# Altium project ESP32 KIT.PrjPcb
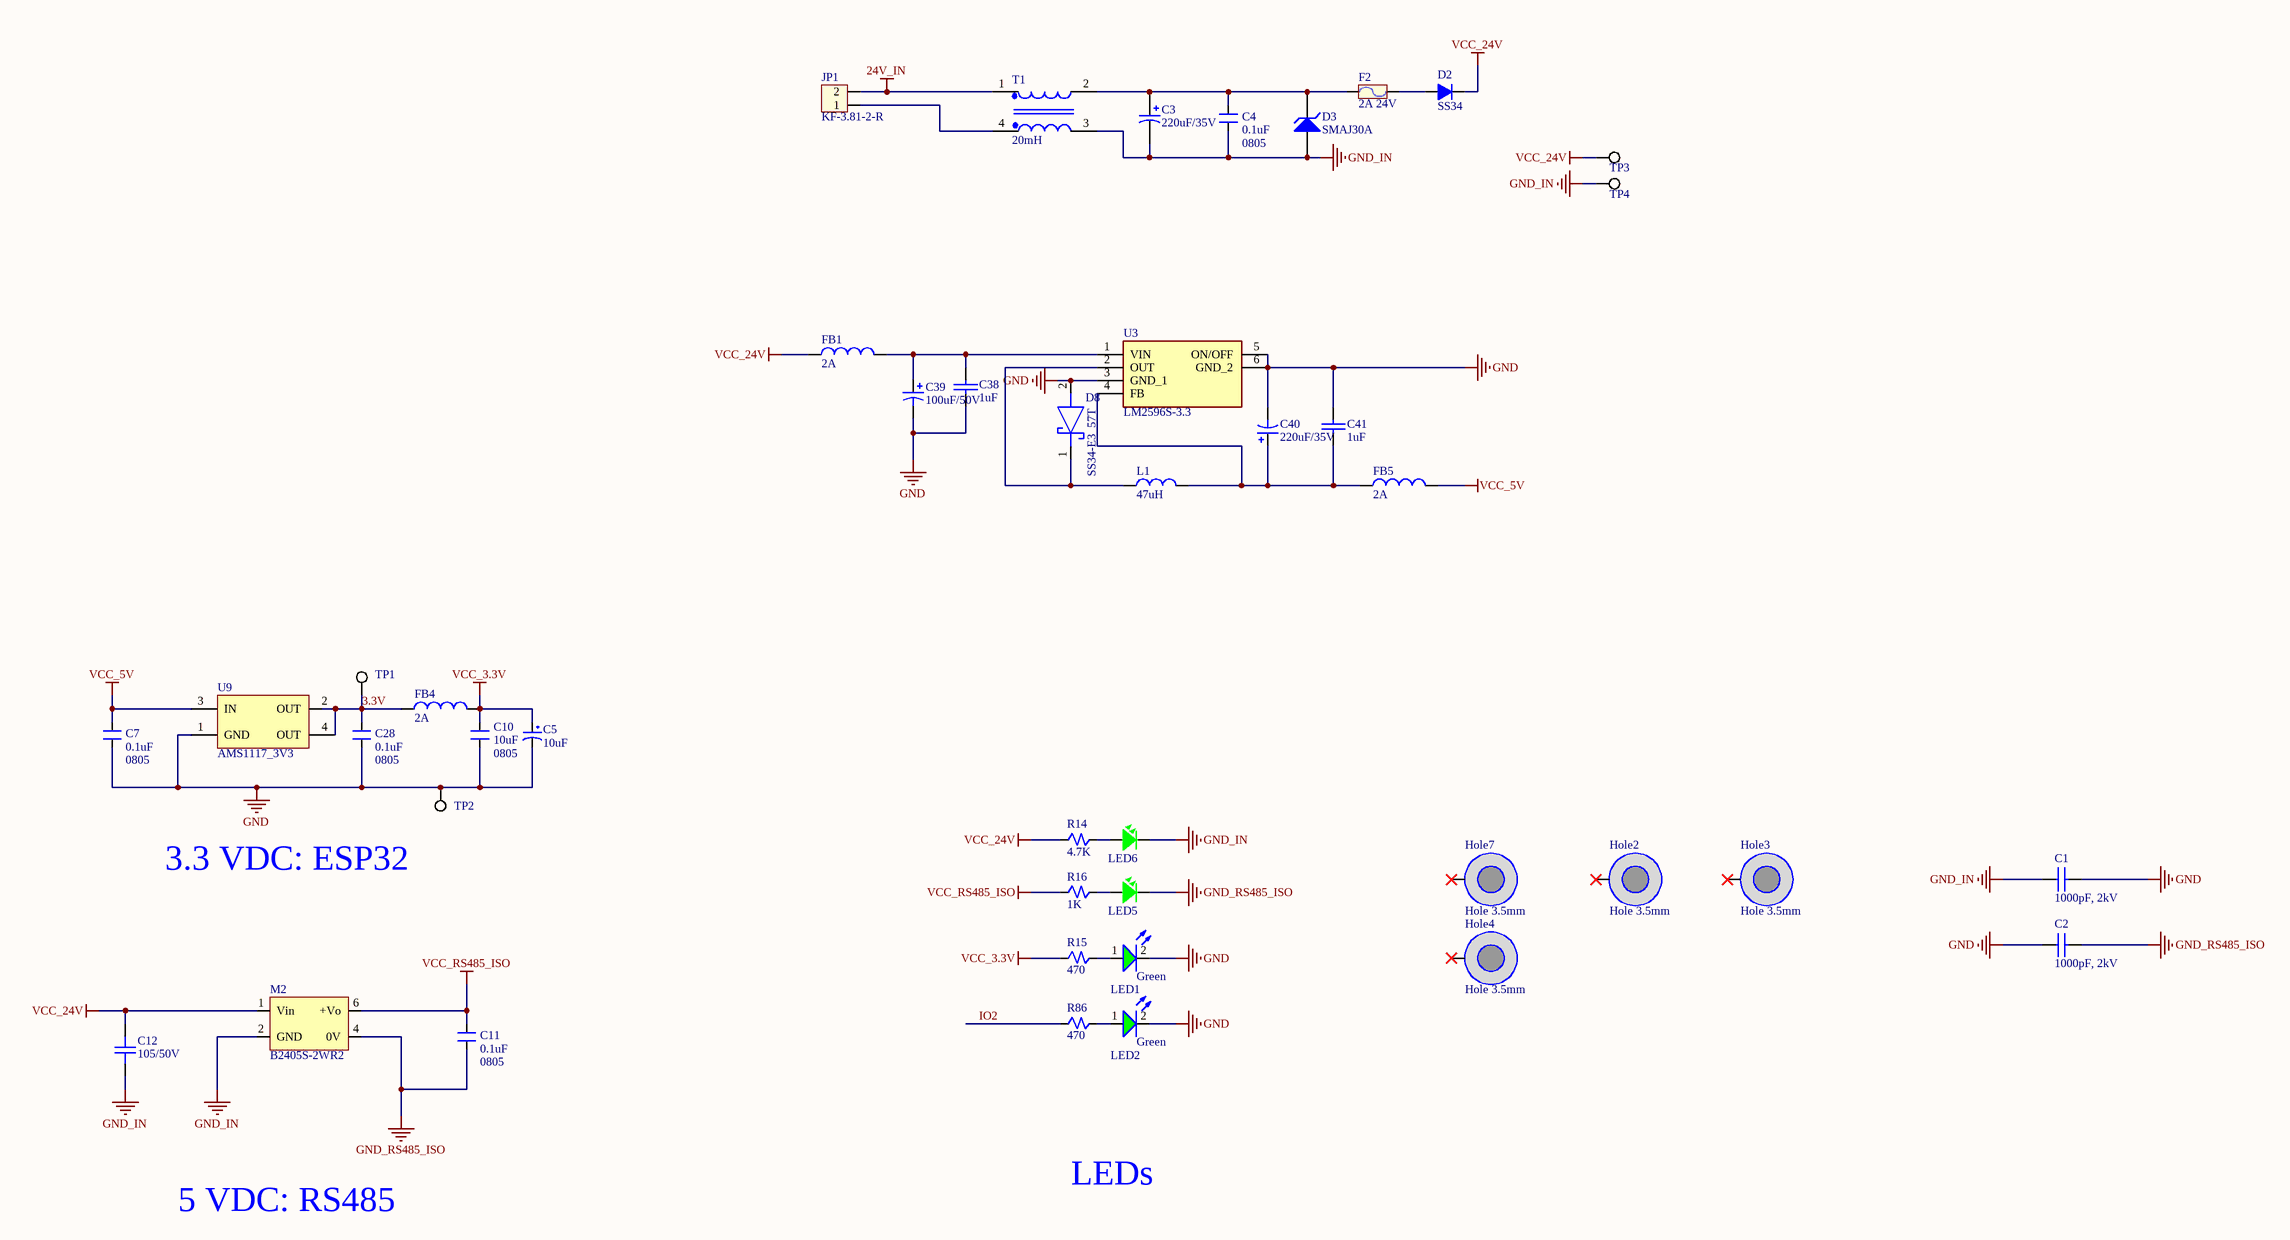
[diagram p0: [1] PWR.SchDoc]
3 sheets, 129 parts. Net scope: global (net labels, ports and power ports of the same name join across sheets).
Board file: ESP32_PCB.PcbDoc
Sheets:
  [1] PWR.SchDoc
  [2] ESP32.SchDoc
  [3] USB.SchDoc

## Sheet [1] PWR.SchDoc: ESP32 KIT
size C; Organization: Altium Limited; Address1: L3, 12a Rodborough Rd; Address2: Frenchs Forest; Address3: NSW; Address4: Australia 2086; DocumentNumber: 1; Revision: 1.0; SheetNumber: 1; SheetTotal: 3

### Parts
C1  1000pF, 2kV  [C1206]
C2  1000pF, 2kV  [C1206]
C3  220uF/35V  [CAP_ALUM_SMD_80102_TYPE_F]
C4  0.1uF  Package: 0805  [CN-SMD-0805]
C5  10uF  [tu tantalum smd3528]
C7  0.1uF  Package: 0805  [CN-SMD-0805]
C10  10uF  Package: 0805  [CN-SMD-0805]
C11  0.1uF  Package: 0805  [CN-SMD-0805]
C12  105/50V  [CAPC-1210 (3225)]
C28  0.1uF  Package: 0805  [CN-SMD-0805]
C38  1uF  [CN-SMD-0805]
C39  100uF/50V  [CAP SMD ALU SIZE F]
C40  220uF/35V  [CAP SMD ALU SIZE F]
C41  1uF  [CN-SMD-0805]
D2  SS34  [diot_smd]
D3  SMAJ30A  [DIODE_DO214AC_SMA]
D8  SS34-E3_57T  [diot_smd]
F2  2A 24V  [RES-SMD-1812]
FB1  2A  [INDC0805]
FB4  2A  [INDC0805]
FB5  2A  [INDC0805]
Hole2  Hole 3.5mm  [Screw Hole 3.5mm]
Hole3  Hole 3.5mm  [Screw Hole 3.5mm]
Hole4  Hole 3.5mm  [Screw Hole 3.5mm]
Hole7  Hole 3.5mm  [Screw Hole 3.5mm]
JP1  KF-3.81-2-R  [KF-3.81-2-R]
L1  47uH  [XL]
LED1  value Green  [LED5G]  (hidden comment: LED_G_5)
LED2  value Green  [LED5G]  (hidden comment: LED_G_5)
LED5  0805 Green  [LED-0805-Blue]  (value not drawn)
LED6  0805 Green  [LED-0805-Blue]  (value not drawn)
M2  B2405S-2WR2  [B_S-2WR2]
R14  4.7K  [RES_0805]
R15  470  [RES_0805]
R16  1K  [RES_0805]
R86  470  [RES_0805]
T1  20mH  [UU9.8-10mH]
TP1  TP 2x2mm  [TP 1.5x1.5mm]  (value not drawn)
TP2  TP 2x2mm  [TP 1.5x1.5mm]  (value not drawn)
TP3  TP 2x2mm  [TP 1.5x1.5mm]  (value not drawn)
TP4  TP 2x2mm  [TP 1.5x1.5mm]  (value not drawn)
U3  LM2596S-3.3  [TO-263]
U9  AMS1117_3V3  [SOT223-4M]

### Nets
24V_IN: JP1.2 T1.1(IN1)
GND: C1.2 C2.1 C5.2 C7.1 C10.1 C28.1 C38.2 C39.2 C40.2 C41.1 D8.2(A) LED1.2(K) LED2.2(K) TP2.3 U3.3(GND_1) U3.5(ON/OFF) U3.6(GND_2) U9.1(GND)
GND_IN: C1.1 C3.2 C4.1 C12.1 D3.1(A) LED6.2 M2.2(GND) T1.3(OUT2) TP4.3
GND_RS485_ISO: C2.2 C11.1 LED5.2 M2.4(0V)
VCC_3.3V: C5.1 C10.2 FB4.2 R15.1
VCC_5V: C7.2 FB5.2 U9.3(IN)
VCC_24V: C12.2 D2.2(K) FB1.1 M2.1(Vin) R14.1 TP3.3
VCC_RS485_ISO: C11.2 M2.6(+Vo) R16.1
3.3V: C28.2 FB4.1 TP1.3 U9.2(OUT) U9.4(OUT)
IO2: R86.1
NetC3_1: C3.1 C4.2 D3.2(K) F2.1 T1.2(IN2)
NetC38_1: C38.1 C39.1 FB1.2 U3.1(VIN)
NetC40_1: C40.1 C41.2 FB5.1 L1.2 U3.4(FB)
NetD2_1: D2.1(A) F2.2
NetD8_1: D8.1(K) L1.1 U3.2(OUT)
NetJP1_1: JP1.1 T1.4(OUT1)
NetLED1_1: LED1.1(A) R15.2
NetLED2_1: LED2.1(A) R86.2
NetLED5_1: LED5.1 R16.2
NetLED6_1: LED6.1 R14.2

Not connected (* = marked no-connect by the designer): Hole2 1(hole)*; Hole3 1(hole)*; Hole4 1(hole)*; Hole7 1(hole)*

### Notes on the sheet
- (near TP2) 3.3 VDC: ESP32
- 5 VDC: RS485
- LEDs
- Title
- Size:
- Date:
- File:
- C
- Number:
- Time:
- Revision:
- Sheet
- of

### Library data of the parts
C1 C2 = C1206X102KGRACTU: CAP CER 1000PF 2000V X7R 1206 FT; Manufacturer: Kemet; .Checked PCB: used; Voltage - Rated: 2000V (2kV); Tolerance: ±10%; Cross PN: C1206C102KGRACAUTO; Cross DES: CAP CER 1000PF 2KV X7R 1206; Capacitance: 1000pF; Category: Capacitors; Supplier Part Number: 399-5830-1-ND; Part Number: C1206X102KGRACTU; Operating Temperature: -55°C ~ 125°C; Package / Case: 1206 (3216 Metric); Price 1k [$]: 0.27600; Value: 1000pF, 2kV; .Checked SCH: used; Supplier: Digikey; Supplier 1: Digi-Key; Supplier Part Number 1: 399-5830-1-ND; RoHS: RoHS Compliant; Stock 1: 2068; Pricing 1: 1=0.92, 10=0.771, 25=0.6324, 100=0.483, 250=0.37952, 500=0.345, 1000=0.276 (USD); Temperature Coefficient: X7R; Mounting Type: Surface Mount, MLCC; Applications: Boardflex Sensitive; Ratings: -; Size / Dimension: 0.134" L x 0.063" W (3.40mm x 1.60mm); Height - Seated (Max): -; Thickness (Max): 0.069" (1.75mm); Lead Spacing: -; Features: Soft Termination, High Voltage; Packaging: Cut Tape (CT); Lead Style: -; ComponentLink1URL: http://www.kemet.com/kemet/web/homepage/kechome.nsf/weben/8311688D32A99EF8852578B500644843/$file/KEM_CC105_HIVOLT.pdf; ComponentLink1Description: http://www.kemet.com/kemet/web/homepage/kechome.nsf/weben/8311688D32A99EF8852578B500644843/$file/KEM_CC105_HIVOLT.pdf; Cross MNF: KEMET
C3 = EEE-FK1V221P: CAP ALUM 220uF 20% 35V SMD; Manufacturer: Panasonic; Solder: SMT; Cross PN: TGIC/25TLV220M8X10.5; Cross DES: Tụ Nhôm SMD 220uF 35V 8x10.5mm; Cross MNF: Thế Giới IC; Value: 220uF/35V; Category: CAPACITOR; PinCount: 2; Part Number: EEE-FK1V221P
C4 C7 C11 C28 = CAP 0.1uF 0805 10% 50V: CAP CER 0.1UF 50V 0805; Manufacturer: Minh Hà; Part Number: Tụ 0805 104-100nF 10% 50V; Tolerance: 10%; Dielectric: X5R; Voltage: 50V; ComponentLink1Description: Link VN; ComponentLink1URL: https://banlinhkien.com/tu-0805-104100nf-10-50v-10c-p6650428.html; Value: 0.1uF; Supplier: Minh Hà; Buy Link: https://banlinhkien.com/tu-0805-104100nf-10-50v-10c-p6650428.html
C5 = Tu tantalum 10uF 16V SMD3528: Dán; Don_Vi: Con; So_Chan: 2; Ten_Linh_Kien: Tụ tantalum 106C-10uF 16V SMD3528; Ma_Hang: MH007474; Chung_Loai: Dán; Kieu_Chan: *
C10 = CAP 10uF 0805 10% 16V: CAP CER 10UF 16V 0805; Manufacturer: Minh Hà; Part Number: Tụ 0805 106-10uF 10% 16V; Tolerance: 10%; Dielectric: X5R; ComponentLink1Description: Link VN; ComponentLink1URL: https://banlinhkien.com/tu-0805-10610uf-10-16v-10c-p6650430.html; Value: 10uF
C12 = CC1210KKX7R9BB105: CAP CER 1UF 50V X7R 1210; Manufacturer: Yageo; Solder: SMT; Value: 105/50V; Category: CAPACITOR; PinCount: 2; Part Number: CC1210KKX7R9BB105
C38 C41 = CAP: Capacitor
C39 = 100uF/50V/RADIAL 8X11.5/20%: CAP ALUM 100UF 20% 50V RADIAL; Manufacturer: Panasonic Electronic Components; Manufacturer Part Number: ECA-1HM101B; Capacitance: 100µF; Lifetime @ Temp.: 2000 Hrs @ 85°C; Ripple Current: 250mA; Supplier 1: Digi-Key; RoHS: RoHS Compliant; Category: Capacitors; Stock 1: 24000; Pricing 1: 1000=0.08607, 2000=0.08154, 5000=0.07701, 10000=0.07248, 25000=0.06795, 50000=0.06342, 100000=0.05889 (USD); Packaging: Tape & Box (TB); Tolerance: ±20%; Voltage Rating: 50V; ESR (Equivalent Series Resistance): -; Operating Temperature: -40°C ~ 85°C; Type: -; Applications: General Purpose; Impedance: -; Lead Spacing: 0.197" (5.00mm); Size / Dimension: 0.315" Dia (8.00mm); Height - Seated (Max): 0.492" (12.50mm); Surface Mount Land Size: -; Mounting Type: Through Hole; Package / Case: Radial, Can; ComponentLink1URL: http://industrial.panasonic.com/www-cgi/jvcr13pz.cgi?E+PZ+3+ABA0012+ECA1HM101B+7+WW; ComponentLink1Description: http://industrial.panasonic.com/www-cgi/jvcr13pz.cgi?E+PZ+3+ABA0012+ECA1HM101B+7+WW
C40 = 270uF/35V/RADIAL 8X11.5/20%: CAP ALUM 270UF 20% 35V RADIAL; Manufacturer: Panasonic Electronic Components; Manufacturer Part Number: EEU-FR1V271LB; Capacitance: 270µF; Lifetime @ Temp.: 8000 Hrs @ 105°C; Ripple Current: 1.24A; Impedance: 41 mOhm; Supplier 1: Digi-Key; RoHS: RoHS Compliant; Category: Capacitors; Stock 1: 2000; Pricing 1: 1000=0.17765, 2000=0.1672, 5000=0.15675, 10000=0.1463, 25000=0.14108, 50000=0.13585, 100000=0.13063 (USD); Packaging: Tape & Box (TB); Tolerance: ±20%; Voltage Rating: 35V; ESR (Equivalent Series Resistance): -; Operating Temperature: -40°C ~ 105°C; Type: -; Applications: General Purpose; Lead Spacing: 0.197" (5.00mm); Size / Dimension: 0.315" Dia (8.00mm); Height - Seated (Max): 0.650" (16.50mm); Surface Mount Land Size: -; Mounting Type: Through Hole; Package / Case: Radial, Can; ComponentLink1URL: http://media.digikey.com/pdf/Data%20Sheets/Panasonic%20Electronic%20Components/EEU-FR_Series.pdf; ComponentLink1Description: http://media.digikey.com/pdf/Data%20Sheets/Panasonic%20Electronic%20Components/EEU-FR_Series.pdf; Supplier Part Number 1: P15388TB-ND
D2 = SS34_SMA: DIODE SMD S3M 1N5822 3A 40V SMA; Manufacturer: Minh Hà; Value: 40V/3A; Part Number: SS34; Current: 3A; Voltage: 40V; Package: SMA; ComponentLink1Description: Link VN; ComponentLink1URL: https://banlinhkien.com/diode-ss34-3a-40v-sma-1n5822-ss34a-p6652165.html
D3 = SMAJ30A: TVS DIODE 30V 48.4V DO214AC; Manufacturer: Littelfuse Inc; Solder: SMT; Value: SMAJ30A; Part Number: SMAJ30A
D8 = SS34-E3_57T: Schottky Diode; Manufacturer_Name: Vishay; Manufacturer_Part_Number: SS34-E3/57T; Datasheet Link: https://www.vishay.com/docs/88751/ss32.pdf; Height: 2.62mm; Arrow Part Number: SS34-E3/57T; Arrow Price/Stock: https://www.arrow.com/en/products/ss34-e357t/vishay; Mouser Part Number: 625-SS34-E3; Mouser Price/Stock: https://www.mouser.co.uk/ProductDetail/Vishay-General-Semiconductor/SS34-E3-57T?qs=x2jpVgRnAtMC3f38kYWnRw%3D%3D
F2 = FUSE 2A 24V: Cầu Chì Tự Phục Hồi 2A 24V SMD1812; Manufacturer: Minh Hà; Part Number: MH010033
FB1 FB4 FB5 = FERRITE BEAD_CBW201209U121T: FERRITE BEAD 100 mOhm DCR 2A 120 OHM 0805; Manufacturer: Fenghua Electronics; Part Number: CBW201209U121T; Supplier: Thế Giới IC; Buy Link: https://www.thegioiic.com/products/cbw201209u121t-ferrite-bead-2a-120-ohm-0805
Hole2-Hole4 Hole7 = Hole 3.5mm: VIT Hole 3.5mm; Part Number: VIT 3.5mm; Manufacturer: Temas
JP1 = Con_2C: Terminal Block Plug-in Hàn PCB Chân Cong 3.81mm; Value: Connector 3; BuyLink: https://www.thegioiic.com/products/kf142-5-08-3-r-terminal-block-3-tiep-diem-cam-day-ngang-5-08mm; ComponentLink1Description: Buy link; ComponentLink1URL: https://www.thegioiic.com/products/kf-3-81-3-r-terminal-block-plug-in-han-pcb-3-chan-cong-3-81mm
L1 = Inductor: Value: 150 mH
LED1 LED2 = LED_GREEN_5MM: LED Green 5mm; ComponentLink1Description: Datasheet; ComponentLink1URL: D:\Dropbox\Datasheets\Opto and Illumination\LEDs\SMD LED.pdf; Unit Price: 0.0476
LED5 LED6 = LED 0805 Màu Xanh Lá (Green): Manufacturer: Minh Hà; Value: Green; Part Number: LED 0805 Màu Xanh Lá (Green); ComponentLink1Description: Link VN; ComponentLink1URL: https://banlinhkien.com/led-0805-mau-xanh-la-green5c-p19524188.html
M2 = B2405S-2WR2: MODULE 24-05V 0.4A Isolated 2W; Manufacturer: Mornsun; Part Number: B2405S-2WR2; ComponentLink1Description: Link VN; ComponentLink1URL: https://www.thegioiic.com/products/b2405s-2wr2-chuyen-doi-dc-dc-vao-24v-ra-5v-2w
R14 = RES 4.7K 0805 1% 1/8W: Điện Trở 4.7 KOhm 0805 1% 1/8W /; Part Number: Trở 0805 1% 4.7K; Manufacturer: Minh Hà; ComponentLink1Description: Link VN; ComponentLink1URL: https://banlinhkien.com/tro-0805-1-4.7k-50c-p12913923.html; Package: 0805; Tolerance: 1%; Power: 1/8W
R15 R86 = RES 470R 0805 1% 1/8W: Điện Trở 470 Ohm 0805 1% 1/8W /; Part Number: Trở 0805 1% 470R; Manufacturer: Minh Hà; ComponentLink1Description: Link VN; ComponentLink1URL: https://banlinhkien.com/tro-0805-1-470r-50c-p17823145.html; Package: 0805; Tolerance: 1%; Power: 1/8W
R16 = RES 1K 0805 1% 1/8W: Điện Trở 1 KOhm 0805 1% 1/8W /; Part Number: Trở 0805 1% 1K; Manufacturer: Minh Hà; ComponentLink1Description: Link VN; ComponentLink1URL: https://banlinhkien.com/tro-0805-1-1k-50c-p6651948.html; Package: 0805; Tolerance: 1%; Power: 1/8W
T1 = UU9.8-203: Power Transformers 20mH; Manufacturer: OEM; ComponentLink1Description: New link; ComponentLink1URL: *; Part Number: UU9.8-203
TP1-TP4 = TP 2x2mm: Test Point 2x2mm; Manufacturer: TEMAS; Part Number: TEST POINT 2x2MM
U3 = LM2596S-3.3: Integrated Circuit; Manufacturer_Name: Texas Instruments; Datasheet Link: http://www.ti.com/lit/ds/symlink/lm2596.pdf; Height: 4.65mm; Manufacturer_Part_Number: LM2596S-3.3; Arrow Part Number: LM2596S-3.3; Arrow Price/Stock: https://www.arrow.com/en/products/lm2596s-3.3/texas-instruments; Mouser Part Number: 926-LM2596S-33; Mouser Price/Stock: https://www.mouser.co.uk/ProductDetail/Texas-Instruments/LM2596S-33?qs=X1J7HmVL2ZHnG50G34wg0g%3D%3D
U9 = AMS1117_3V3: 1A Regulator

## Sheet [2] ESP32.SchDoc: ESP32 KIT
size C; Organization: Altium Limited; Address1: L3, 12a Rodborough Rd; Address2: Frenchs Forest; Address3: NSW; Address4: Australia 2086; DocumentNumber: 2; Revision: 1.0; SheetNumber: 2; SheetTotal: 3
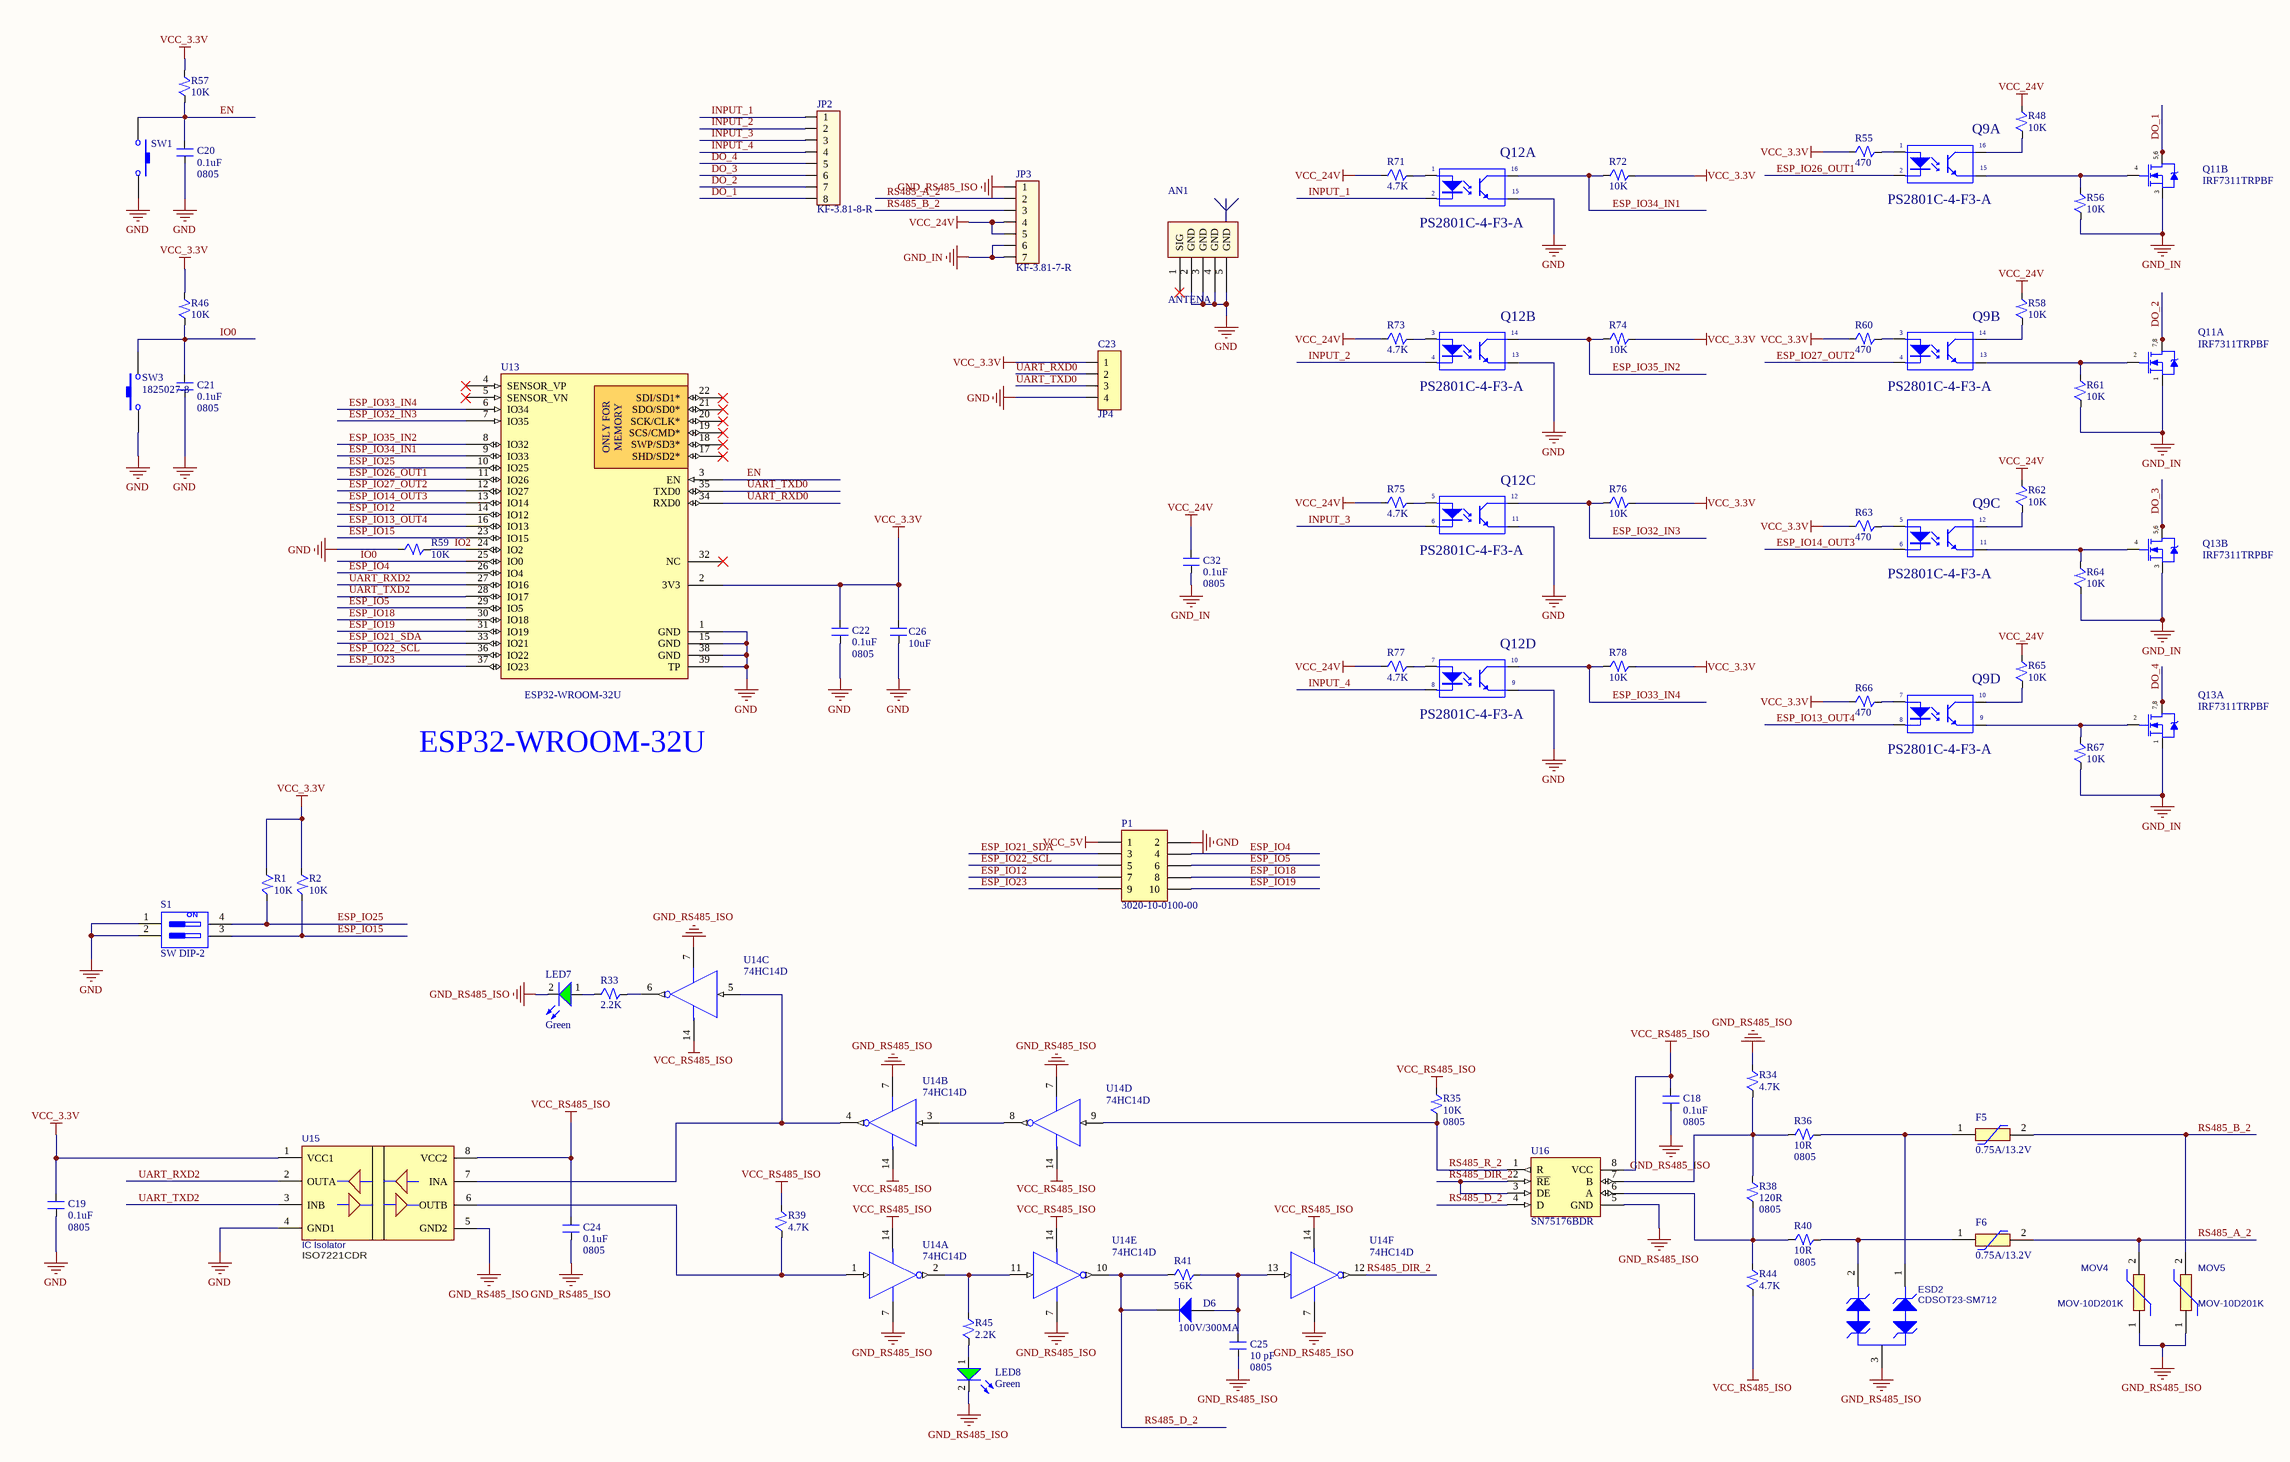
[diagram p1: [2] ESP32.SchDoc]

### Parts
AN1  ANTENA  [DE ANTEN SMA CONG]
C18  0.1uF  Package: 0805  [CN-SMD-0805]
C19  0.1uF  Package: 0805  [CN-SMD-0805]
C20  0.1uF  Package: 0805  [CN-SMD-0805]
C21  0.1uF  Package: 0805  [CN-SMD-0805]
C22  0.1uF  Package: 0805  [CN-SMD-0805]
C23  JP4  [JP4-C1T]
C24  0.1uF  Package: 0805  [CN-SMD-0805]
C25  10 pF  Package: 0805  [CN-SMD-0805]
C26  10uF  [CN-SMD-0805]
C32  0.1uF  Package: 0805  [CN-SMD-0805]
D6  100V/300MA  [SOD-123]
ESD2  CDSOT23-SM712  [SOT-323_ESD]
F5  0.75A/13.2V  [MINISMDC050F2]
F6  0.75A/13.2V  [MINISMDC050F2]
JP2  KF-3.81-8-R  [KF-3.81-8-R]
JP3  KF-3.81-7-R  [KF-3.81-7-R]
LED7  value Green  [LED5G]  (hidden comment: LED_G_5)
LED8  value Green  [LED5G]  (hidden comment: LED_G_5)
MOV4  MOV-10D201K  [MOV10D201KTR]
MOV5  MOV-10D201K  [MOV10D201KTR]
P1  3020-10-0100-00  [IDC_HDR_M_2X5_2.54_THG]
Q9  PS2801C-4-F3-A  [PS2801C-4_REN-L]  (parts A,B,C,D of 4)
Q11  IRF7311TRPBF  [SO8]  (parts A,B of 2)
Q12  PS2801C-4-F3-A  [PS2801C-4_REN-L]  (parts A,B,C,D of 4)
Q13  IRF7311TRPBF  [SO8]  (parts A,B of 2)
R1  10K  [RES_0805]
R2  10K  [RES_0805]
R33  2.2K  [RES_0805]
R34  4.7K  [RES_0805]
R35  10K  Package: 0805  [RES_0805]
R36  10R  Package: 0805  [RES_0805]
R38  120R  Package: 0805  [RES_0805]
R39  4.7K  [RES_0805]
R40  10R  Package: 0805  [RES_0805]
R41  56K  [RES_0805]
R44  4.7K  [RES_0805]
R45  2.2K  [RES_0805]
R46  10K  [RES_0805]
R48  10K  [RES_0805]
R55  470  [RES_0805]
R56  10K  [RES_0805]
R57  10K  [RES_0805]
R58  10K  [RES_0805]
R59  10K  [RES_0805]
R60  470  [RES_0805]
R61  10K  [RES_0805]
R62  10K  [RES_0805]
R63  470  [RES_0805]
R64  10K  [RES_0805]
R65  10K  [RES_0805]
R66  470  [RES_0805]
R67  10K  [RES_0805]
R71  4.7K  [RES_0805]
R72  10K  [RES_0805]
R73  4.7K  [RES_0805]
R74  10K  [RES_0805]
R75  4.7K  [RES_0805]
R76  10K  [RES_0805]
R77  4.7K  [RES_0805]
R78  10K  [RES_0805]
S1  SW DIP-2  [DIP-SW-2-SIDE ENTRY]
SW1  RS-282G05A3-SM RT  [SW_RS-282G05A3-SM RT]  (value not drawn)
SW3  1825027-8  [SW_1825027-8]
U13  ESP32-WROOM-32U  [ESP32-WROOM-32U]
U14  74HC14D  [SOIC-14]  (parts A,B,C,D,E,F of 6)
U15  IC Isolator  Part Number: ISO7221CDR  [8-SOIC_ISO]
U16  SN75176BDR  [SOIC-8]

### Nets
GND: AN1.2(GND) AN1.3(GND) AN1.4(GND) AN1.5(GND) C19.1 C20.1 C21.1 C22.1 C23.4 C26.1 P1.2 Q12.9 Q12.11 Q12.13 Q12.15 R59.1 S1.1(A1) S1.2(A2) SW1.2 SW3.1 U13.1(GND) U13.15(GND) U13.38(GND) U13.39(TP) U15.4(GND1)
GND_IN: C32.1 JP3.6 JP3.7 Q11.1(S) Q11.3(S) Q13.1(S) Q13.3(S) R56.1 R61.1 R64.1 R67.1
GND_RS485_ISO: C18.1 C24.1 C25.1 ESD2.3(A) JP3.1 LED7.2(K) LED8.2(K) MOV4.1 MOV5.1 R34.2 U14.7(GND) U15.5(GND2) U16.5(GND)
VCC_3.3V: C19.2 C22.2 C23.1 C26.2 R1.1 R2.1 R46.2 R55.1 R57.2 R60.1 R63.1 R66.1 R72.2 R74.2 R76.2 R78.2 U13.2(3V3) U15.1(VCC1)
VCC_5V: P1.1
VCC_24V: C32.2 JP3.4 JP3.5 R48.2 R58.2 R62.2 R65.2 R71.1 R73.1 R75.1 R77.1
VCC_RS485_ISO: C18.2 C24.2 R35.2 R39.2 R44.1 U14.14(VCC) U15.8(VCC2) U16.8(VCC)
DO_1: JP2.8 Q11.5(D) Q11.6(D)
DO_2: JP2.7 Q11.7(D) Q11.8(D)
DO_3: JP2.6 Q13.5(D) Q13.6(D)
DO_4: JP2.5 Q13.7(D) Q13.8(D)
EN: C20.2 R57.1 SW1.1 U13.3(EN)
ESP_IO4: P1.4 U13.26(IO4)
ESP_IO5: P1.6 U13.29(IO5)
ESP_IO12: P1.7 U13.14(IO12)
ESP_IO13_OUT4: Q9.8 U13.16(IO13)
ESP_IO14_OUT3: Q9.6 U13.13(IO14)
ESP_IO15: R2.2 S1.3(B2) U13.23(IO15)
ESP_IO18: P1.8 U13.30(IO18)
ESP_IO19: P1.10 U13.31(IO19)
ESP_IO21_SDA: P1.3 U13.33(IO21)
ESP_IO22_SCL: P1.5 U13.36(IO22)
ESP_IO23: P1.9 U13.37(IO23)
ESP_IO25: R1.2 S1.4(B1) U13.10(IO25)
ESP_IO26_OUT1: Q9.2 U13.11(IO26)
ESP_IO27_OUT2: Q9.4 U13.12(IO27)
ESP_IO32_IN3: Q12.12 R76.1 U13.7(IO35)
ESP_IO33_IN4: Q12.10 R78.1 U13.6(IO34)
ESP_IO34_IN1: Q12.16 R72.1 U13.9(IO33)
ESP_IO35_IN2: Q12.14 R74.1 U13.8(IO32)
INPUT_1: JP2.1 Q12.2
INPUT_2: JP2.2 Q12.4
INPUT_3: JP2.3 Q12.6
INPUT_4: JP2.4 Q12.8
IO0: C21.2 R46.1 SW3.2 U13.25(IO0)
IO2: R59.2 U13.24(IO2)
RS485_A_2: F6.2 JP3.2 MOV4.2
RS485_B_2: F5.2 JP3.3 MOV5.2
RS485_D_2: D6.2(K) R41.1 U14.10(5Y) U16.4(D)
RS485_DIR_2: U14.12(6Y) U16.2(~{RE}) U16.3(DE)
RS485_R_2: R35.1 U14.9(4A) U16.1(R)
UART_RXD0: C23.2 U13.34(RXD0)
UART_RXD2: U13.27(IO16) U15.2(OUTA)
UART_TXD0: C23.3 U13.35(TXD0)
UART_TXD2: U13.28(IO17) U15.3(INB)
NetC25_2: C25.2 D6.1(A) R41.2 U14.13(6A)
NetESD2_1: ESD2.1(K) F5.1 R36.2
NetESD2_2: ESD2.2(K) F6.1 R40.2
NetLED7_1: LED7.1(A) R33.1
NetLED8_1: LED8.1(A) R45.1
NetQ9_1: Q9.1 R55.2
NetQ9_3: Q9.3 R60.2
NetQ9_5: Q9.5 R63.2
NetQ9_7: Q9.7 R66.2
NetQ9_9: Q9.9 Q13.2(G) R67.2
NetQ9_10: Q9.10 R65.1
NetQ9_11: Q9.11 Q13.4(G) R64.2
NetQ9_12: Q9.12 R62.1
NetQ9_13: Q9.13 Q11.2(G) R61.2
NetQ9_14: Q9.14 R58.1
NetQ9_15: Q9.15 Q11.4(G) R56.2
NetQ9_16: Q9.16 R48.1
NetQ12_1: Q12.1 R71.2
NetQ12_3: Q12.3 R73.2
NetQ12_5: Q12.5 R75.2
NetQ12_7: Q12.7 R77.2
NetR33_2: R33.2 U14.6(3Y)
NetR34_1: R34.1 R36.1 R38.2 U16.7(B)
NetR38_1: R38.1 R40.1 R44.2 U16.6(A)
NetR39_1: R39.1 U14.1(1A) U15.6(OUTB)
NetR45_2: R45.2 U14.2(1Y) U14.11(5A)
NetU14_3: U14.3(2A) U14.8(4Y)
NetU14_4: U14.4(2Y) U14.5(3A) U15.7(INA)

Not connected (* = marked no-connect by the designer): AN1 1(SIG)*; U13 4(SENSOR_VP)* 5(SENSOR_VN)* 17(SHD/SD2*)* 18(SWP/SD3*)* 19(SCS/CMD*)* 20(SCK/CLK*)* 21(SDO/SD0*)* 22(SDI/SD1*)* 32(NC)*

### Notes on the sheet
- ESP32-WROOM-32U
- Title
- Size:
- Date:
- File:
- C
- Number:
- Time:
- Revision:
- Sheet
- of
- (in symbol ESP32-WROOM-32U) ONLY FOR; MEMORY
- (in symbol IRF7311TRPBF, part A) 7,8
- (in symbol IRF7311TRPBF, part B) 5,6
- (in symbol SW DIP-2) ON

### Library data of the parts
AN1 = ANTEN SMA CONG: Generic Antenna
C18-C22 C24 C25 C32 = CAP 0.1uF 0805 10% 50V: as C4 on sheet [1] PWR; Voltage: 50V; ComponentLink1Description: Link VN; ComponentLink1URL: https://banlinhkien.com/tu-0805-104100nf-10-50v-10c-p6650428.html; Value: 0.1uF; Supplier: Minh Hà; Buy Link: https://banlinhkien.com/tu-0805-104100nf-10-50v-10c-p6650428.html
C23 = JP4: WR-PHD 2.54 mm Angled Socket Header; Manufacturer: W¨¹rth Elektronik eiSos GmbH; partNo: 613004143121; ComponentLink1 Description: Manufacturer; ComponentLink2 Description: Datasheet; NoPins: 04; Created Date: 29 March 2013; ComponentLink1URL: http://www.we-online.com; ComponentLink2URL: http://katalog.we-online.de/em/datasheet/6130xx143121.pdf; Created by: Karrer Zheng
C26 = CAP 10uF 0805 10% 16V: as C10 on sheet [1] PWR; Package: 0805; Voltage: 16V; ComponentLink1Description: Link VN; ComponentLink1URL: https://banlinhkien.com/tu-0805-10610uf-10-16v-10c-p6650430.html; Value: 10uF
D6 = 1N4148-W-7: DIODE GEN PURP 100V 300MA SOD123; Part Number: 1N4148W-7-F; Manufacturer: Diodes Incorporated; Value: 100V/300MA
ESD2 = CDSOT23-SM712: ESD 2 channel 12V, 26V Max Voltage Clamp 17A, 13.3V Typ Breakdown Voltage, Max -V Reverse Standoff Voltage, Bidirectional, Capacitance 75 pF Typ; Manufacturer: Bourns; Ma thay the VN: No; Cross PN: PESD24VL2BT,215; Cross DES: TVS DIODE 24VWM 70VC TO236AB 70V Clamp 3A; Cross MNF: Nexperia USA Inc.; Part Number: CDSOT23-SM712; ComponentLink1Description: Datasheet; ComponentLink1URL: https://www.mouser.vn/datasheet/2/54/CDSOT23-SM712-1635169.pdf; ComponentLink2Description: Link tham khao; ComponentLink2URL: https://www.mouser.vn/ProductDetail/Bourns/CDSOT23-SM712?qs=FuI%252BOVLl4%2FLTY%2FGQ265RLA%3D%3D; ComponentLink3Description: Link VN; ComponentLink3URL: No; Type: ESD
F5 F6 = MINISMDC075F-2: PTC RESET FUSE 13.2V 750MA 1812; Manufacturer: LITTELFUSE; Datasheet Link: https://componentsearchengine.com/Datasheets/2/MINISMDC050F-2.pdf; Part Number: MINISMDC075F-2
JP2 = Con_8C: Terminal Block Plug-in Hàn PCB Chân Cong 3.81mm; Value: Connector 3; BuyLink: https://www.thegioiic.com/products/kf142-5-08-3-r-terminal-block-3-tiep-diem-cam-day-ngang-5-08mm; ComponentLink1Description: Buy link; ComponentLink1URL: https://www.thegioiic.com/products/kf-3-81-3-r-terminal-block-plug-in-han-pcb-3-chan-cong-3-81mm
JP3 = Con_7C: Terminal Block Plug-in Hàn PCB Chân Cong 3.81mm; Value: Connector 3; BuyLink: https://www.thegioiic.com/products/kf142-5-08-3-r-terminal-block-3-tiep-diem-cam-day-ngang-5-08mm; ComponentLink1Description: Buy link; ComponentLink1URL: https://www.thegioiic.com/products/kf-3-81-3-r-terminal-block-plug-in-han-pcb-3-chan-cong-3-81mm
LED7 LED8 = LED_GREEN_5MM: LED Green 5mm; ComponentLink1Description: Datasheet; ComponentLink1URL: D:\Dropbox\Datasheets\Opto and Illumination\LEDs\SMD LED.pdf; Unit Price: 0.0476
MOV4 MOV5 = MOV-10D201K: MOV 225V 250pF 340V Clamp Voltage 2.5 kA 10%; Manufacturer: Bourns; Ma thay the VN: No; Part Number: MOV-10D201K; ComponentLink1Description: Datasheet; ComponentLink1URL: https://www.mouser.vn/datasheet/2/54/mov10d-777448.pdf; ComponentLink2Description: Link tham khao; ComponentLink2URL: https://www.mouser.vn/ProductDetail/Bourns/MOV-10D201K?qs=lgttKnAd%252B2CB2e2%2FC517%252BQ%3D%3D; ComponentLink3Description: Link VN; ComponentLink3URL: No; Type: Varistor
P1 = IDC_HDR_M_3020-10-0100-00: IDC BOX HEADER .100" 10POS; Manufacturer: CNC Tech; Pitch - Mating: 0.100" (2.54mm); Number of Positions: 10; Number of Positions Loaded: All; Style: Board to Cable/Wire; Shrouding: Shrouded - 4 Wall; Contact Length - Post: 0.118" (3.00mm); Material Flammability Rating: UL94 V-0; Current Rating: 1A; Supplier 1: Digi-Key; Manufacturer Part Number: 3020-10-0100-00; RoHS: RoHS Compliant; Category: Connectors, Interconnects; Stock 1: 24035; Pricing 1: 1=0.48, 10=0.45, 100=0.345, 500=0.3, 1000=0.2475, 5000=0.2175, 10000=0.2025 (USD); Packaging: Tray; Part Status: Active; Connector Type: Header; Contact Type: Male Pin; Number of Rows: 2; Row Spacing - Mating: 0.100" (2.54mm); Mounting Type: Through Hole; Termination: Solder; Fastening Type: Push-Pull; Contact Length - Mating: -; Overall Contact Length: -; Insulation Height: 0.354" (9.00mm); Contact Shape: Square; Contact Finish - Mating: Gold; Contact Finish Thickness - Mating: Flash; Contact Finish - Post: -; Contact Material: Brass; Insulation Material: Polyamide (PA6T), Nylon 6T; Features: Keying Slot; Operating Temperature: -40°C ~ 105°C; Ingress Protection: -; Insulation Color: -; Voltage Rating: -; Mated Stacking Heights: -; Contact Finish Thickness - Post: -; Applications: -; ComponentLink1URL: http://cnctech.us/pdfs/3020-XX-0100-00.pdf; ComponentLink1Description: http://cnctech.us/pdfs/3020-XX-0100-00.pdf; Supplier Part Number 1: 1175-1609-ND
Q9 Q12 = PS2801C-4_MH: Manufacturer: Renesas Electronics; Datasheet: https://www.renesas.com/us/en/doc/products/opt/r08ds0072ej0402-ps2801c-1-ps2801c-4.pdf; Part Number: PS2801C-4-F3-A; ComponentLink1Description: Link VN; ComponentLink1URL: https://banlinhkien.com/ps28014-sop16-ic-opto-trans-50ma-80v-p6650617.html
Q11 Q13 = IRF7311TRPBF: MOSFET N-2CH 6.6A 20V 29mOhm 8-SOIC; Manufacturer: Infineon Technologies; Cross PN: AO4818B/NTMD4840NR2G; Cross DES: MOSFET 2N-CH 30V 8A 8-SOIC; Cross MNF: Alpha & Omega Semiconductor Inc.; Published: 8-Jun-2000; LatestRevisionDate: 13-Apr-2006; LatestRevisionNote: IPC-7351 Footprint Added.; DatasheetVersion: Aug-1997; PackageVersion: Feb-2001; PackageReference: SO-8; Publisher: Altium Limited; PackageDescription: 8-Pin Plastic Small Outline Integrated Circuit 1.27 mm Pitch; Code_JEDEC: MS-012-AA; Code_IPC: SOIC127P600-8; ComponentLink1Description: Manufacturer Link; ComponentLink1URL: http://www.irf.com/; ComponentLink2Description: Datasheet; ComponentLink2URL: https://www.infineon.com/dgdl/irf7311pbf.pdf?fileId=5546d462533600a4015355f551ed1b22; Part Number: IRF7311TRPBF
R1 R2 R35 R46 R48 R56-R59 R61 R62 R64 R65 R67 R72 R74 R76 R78 = RES 10K 0805 1% 1/8W: Điện Trở 10 KOhm 0805 1% 1/8W /; Part Number: Trở 0805 1% 10K; Manufacturer: Minh Hà; ComponentLink1Description: Link VN; ComponentLink1URL: https://banlinhkien.com/tro-0805-1-10k-50c-p6651952.html; Tolerance: 1%; Power: 1/8W
  R1 R2 R46 R48 R56-R59 R61 R62 R64 R65 R67 R72 R74 R76 R78: Package: 0805
R33 R45 = RES 2.2K 0805 1% 1/8W: Điện Trở 2.2 KOhm 0805 1% 1/8W /; Part Number: Trở 0805 1% 2.2K; Manufacturer: Minh Hà; ComponentLink1Description: Link VN; ComponentLink1URL: https://banlinhkien.com/tro-0805-1-2.2k-50c-p17663512.html; Package: 0805; Tolerance: 1%; Power: 1/8W
R34 R39 R44 R71 R73 R75 R77 = RES 4.7K 0805 1% 1/8W: as R14 on sheet [1] PWR; ComponentLink1Description: Link VN; ComponentLink1URL: https://banlinhkien.com/tro-0805-1-4.7k-50c-p12913923.html; Package: 0805; Tolerance: 1%; Power: 1/8W
R36 R40 = RES 10R 0805 1% 1/8W: Điện Trở 10 Ohm 0805 1% 1/8W /; Part Number: Trở 0805 1% 10R; Manufacturer: Minh Hà; ComponentLink1Description: Link VN; ComponentLink1URL: https://banlinhkien.com/tro-0805-1-10r-50c-p6651953.html; Tolerance: 1%; Power: 1/8W
R38 = RES 120R 0805 1% 1/8W: Điện Trở 120 Ohm 0805 1% 1/8W /; Part Number: Trở 0805 1% 120R; Manufacturer: Minh Hà; ComponentLink1Description: Link VN; ComponentLink1URL: https://banlinhkien.com/tro-0805-1-120r-50c-p17332149.html; Tolerance: 1%; Power: 1/8W
R41 = RES 56K 0805 5% 1/8W: Điện Trở 56 KOhm 0805 5% 1/8W /; Part Number: Trở 0805 5% 56K; Manufacturer: Thế Giới IC; ComponentLink1Description: Link VN; ComponentLink1URL: https://www.thegioiic.com/products/dien-tro-56-kohm-0805-5; Package: 0805; Tolerance: 5%; Power: 1/8W
R55 R60 R63 R66 = RES 470R 0805 1% 1/8W: as R15 on sheet [1] PWR; ComponentLink1Description: Link VN; ComponentLink1URL: https://banlinhkien.com/tro-0805-1-470r-50c-p17823145.html; Package: 0805; Tolerance: 1%; Power: 1/8W
S1 = SW DIP-2: DIP Switch, 2 Position, SPST; Published: 24-Mar-1999; LatestRevisionDate: 17-Jul-2002; LatestRevisionNote: Re-released for DXP Platform.; PackageReference: DIP-4; Publisher: Altium Limited
SW1 = SW_RS-282G05A3-SM RT: SWITCH TACTILE SPST-NO 0.05A 12V; Manufacturer: C&K; Switch Function: Off-Mom; Contact Rating @ Voltage: 0.05A @ 12VDC; Actuator Type: Rectangular Button; Actuator Height off PCB, Vertical: 2.50mm; Actuator Orientation: Top Actuated; Outline: 6.00mm x 3.60mm; Illumination: Non-Illuminated; Operating Force: 250gf; Actuator Material: Polyamide (PA), Nylon; Switch Travel: 0.25mm; Mechanical Life: 50,000 Cycles; Supplier 1: Digi-Key; Part Number: RS-282G05A3-SM RT; RoHS: RoHS Compliant; Category: Switches; Stock 1: 34459; Pricing 1: 1=0.81, 10=0.78, 25=0.7356, 50=0.6474, 100=0.5885, 250=0.55908, 500=0.54436, 1000=0.42666 (USD); Packaging: Digi-Reel®; Part Status: Active; Circuit: SPST-NO; Mounting Type: Surface Mount; Actuator Length, Right Angle: -; Termination Style: Gull Wing; Illumination Type, Color: -; Illumination Voltage (Nominal): -; Ingress Protection: -; Features: -; Operating Temperature: -; ComponentLink1URL: http://media.digikey.com/pdf/Data%20Sheets/C&K/RS-282G05A-SM_RT.pdf; ComponentLink1Description: http://media.digikey.com/pdf/Data%20Sheets/C&K/RS-282G05A-SM_RT.pdf; Supplier Part Number 1: CKN10384DKR-ND
SW3 = SW_1825027-8: SWITCH TACTILE SPST-NO 0.05A 24V; Manufacturer: TE Connectivity ALCOSWITCH Switches; Switch Function: Off-Mom; Contact Rating @ Voltage: 0.05A @ 24VDC; Actuator Type: Standard; Actuator Length, Right Angle: 5.85mm; Actuator Orientation: Side Actuated; Outline: 7.10mm x 7.00mm; Illumination: Non-Illuminated; Operating Force: 160gf; Actuator Material: Polyamide (PA), Nylon; Switch Travel: 0.25mm; Mechanical Life: 100,000 Cycles; Supplier 1: Digi-Key; Manufacturer Part Number: 1825027-8; RoHS: RoHS Compliant; Category: Switches; Stock 1: 10500; Pricing 1: 1=0.14, 10=0.132, 25=0.1276, 50=0.1228, 100=0.116, 250=0.1092, 500=0.10466, 1000=0.07963, 5000=0.06598 (USD); Packaging: Bulk; Part Status: Active; Circuit: SPST-NO; Mounting Type: Through Hole, Right Angle; Actuator Height off PCB, Vertical: -; Termination Style: PC Pin; Illumination Type, Color: -; Illumination Voltage (Nominal): -; Ingress Protection: -; Features: -; Operating Temperature: -35°C ~ 85°C; ComponentLink1URL: http://www.te.com/commerce/DocumentDelivery/DDEController?Action=srchrtrv&DocNm=1825027&DocType=Customer+Drawing&DocLang=English; ComponentLink1Description: http://www.te.com/commerce/DocumentDelivery/DDEController?Action=srchrtrv&DocNm=1825027&DocType=Customer+Drawing&DocLang=English; Supplier Part Number 1: 450-1657-ND
U13 = ESP32-WROOM-32U: Wi-Fi/BT BLE Module ESP32-D0WD; Manufacturer: Espressif; Solder: SMT; Price: None; Value: ESP32-WROOM-32U; Supplier: Thế Giới IC; Buy Link: https://www.thegioiic.com/products/esp-wroom-32u-mach-thu-phat-wifi; Part Number: ESP32-WROOM-32U; PinCount: 40; ComponentLink1Description: Link VN; ComponentLink1URL: https://www.thegioiic.com/products/esp-wroom-32u-mach-thu-phat-wifi
U14 = 74HC14D_NXP: IC INVERTER SCHMITT TRIGGER 6CH 6-INP; Manufacturer: Nexperia USA Inc; Number of Inputs: 6; Voltage - Supply: 2 V ~ 6 V; Current - Output High, Low: 5.2mA, 5.2mA; Logic Level - Low: 0.3 V ~ 1.2 V; Logic Level - High: 1.5 V ~ 4.2 V; Max Propagation Delay @ V, Max CL: 21ns @ 6V, 50pF; Supplier 1: Digi-Key; Part Number: 74HC14D; RoHS: RoHS Compliant; Category: Integrated Circuits (ICs); Stock 1: 7794; Pricing 1: 1=0.37, 10=0.278, 100=0.1733, 500=0.11856, 1000=0.0912 (USD); Packaging: Tube; Part Status: Active; Logic Type: Inverter; Features: Schmitt Trigger; Operating Temperature: -40°C ~ 125°C; Mounting Type: Surface Mount; Supplier Device Package: 14-SO; Package / Case: 14-SOIC (0.154", 3.90mm Width); Base Part Number: 74HC14; ComponentLink1URL: https://assets.nexperia.com/documents/data-sheet/74HC_HCT14.pdf; ComponentLink1Description: https://assets.nexperia.com/documents/data-sheet/74HC_HCT14.pdf; Supplier Part Number 1: 1727-3781-ND; ComponentLink2Description: Link VN; ComponentLink2URL: https://banlinhkien.com/74hc14d-sop14-p6648430.html
U15 = ISO7221CD: IC Isolator 2.8V ~ 5.5V 2 Channels 25Mbps; Manufacturer: Texas Instruments; Ma thay the VN: No; ComponentLink1Description: Datasheet; ComponentLink1URL: https://www.ti.com/lit/ds/symlink/iso7220a.pdf?HQS=dis-dk-null-digikeymode-dsf-pf-null-wwe&ts=1644914438304&ref_url=https%253A%252F%252Fwww.ti.com%252Fgeneral%252Fdocs%252Fsuppproductinfo.tsp%253FdistId%253D10%2526gotoUrl%253Dhttps%253A%252F%252Fwww.ti.com%252Flit%252Fgpn%252Fiso7220a; ComponentLink2Description: Link tham khao; ComponentLink2URL: https://www.lcsc.com/product-detail/Pre-ordered-Products_Texas-Instruments-ISO7221CD_C2872999.html; ComponentLink3Description: Link VN; ComponentLink3URL: No; Type: IC; Supplier: Shenzhen JYWY Electronics
U16 = SN75176BDR: IC TXRX DIFF BUSS 8SOIC; Manufacturer: Texas Instruments; Part Number: SN75HVD08DR; Protocol: RS422, RS485; Number of Drivers/Receivers: 1/1; Duplex: Half; Voltage - Supply: 4.75 V ~ 5.25 V; Supplier 1: Digi-Key; Manufacturer Part Number: SN75176BDR; RoHS: RoHS Compliant; Category: Integrated Circuits (ICs); Stock 1: 19898; Pricing 1: 1=1.46, 10=1.31, 100=1.021, 500=0.84346, 1000=0.6659 (USD); Packaging: Cut Tape (CT); Part Status: Active; Type: Transceiver; Data Rate: -; Operating Temperature: 0°C ~ 70°C; Mounting Type: Surface Mount; Package / Case: 8-SOIC (0.154", 3.90mm Width); Supplier Device Package: 8-SOIC; ComponentLink1URL: http://www.ti.com/lit/ds/symlink/sn65176b.pdf; ComponentLink1Description: http://www.ti.com/lit/ds/symlink/sn65176b.pdf; Supplier Part Number 1: 296-1275-1-ND; Supplier: EPI; Buy Link: N/A

## Sheet [3] USB.SchDoc: ESP32 KIT
size C; DocumentNumber: 3; SheetNumber: 3; SheetTotal: 3
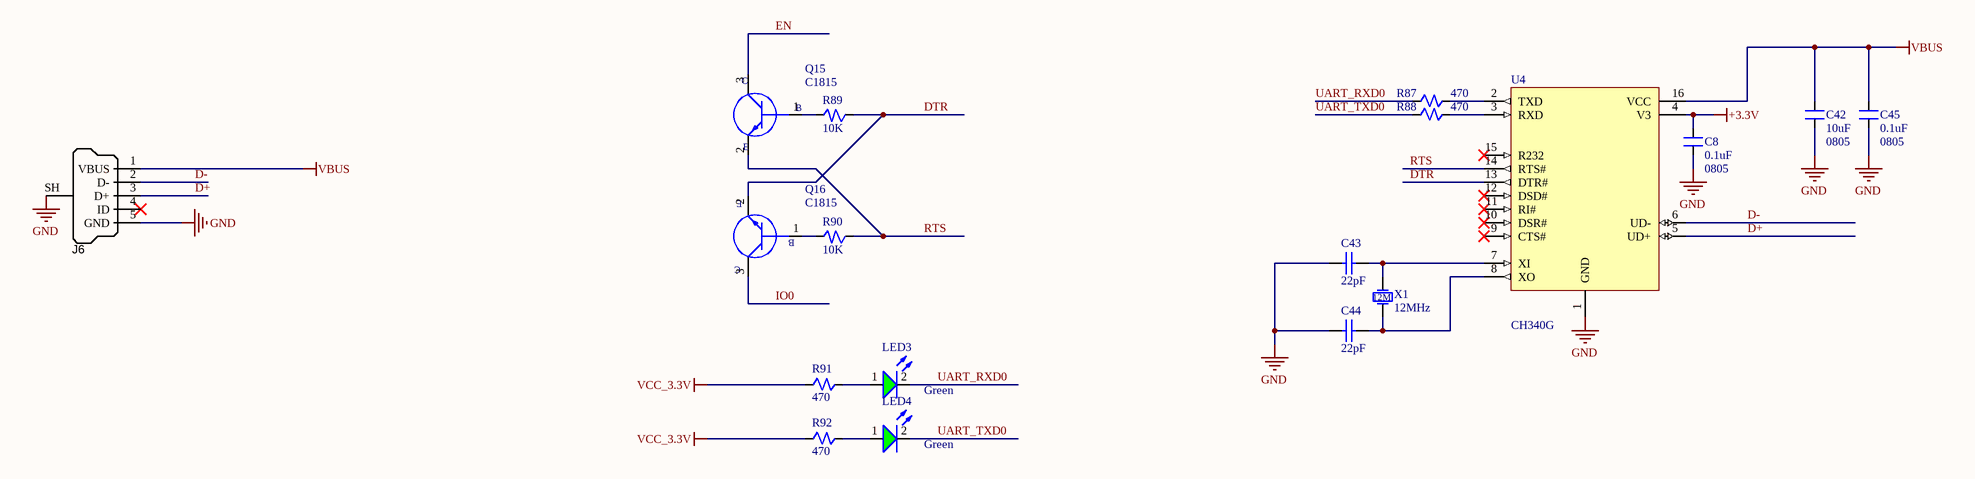
[diagram p2: [3] USB.SchDoc]

### Parts
C8  0.1uF  Package/Case: 0805  [SM-0805]
C42  10uF  Package/Case: 0805  [SM-0805]
C43  22pF  [tu 0805]
C44  22pF  [tu 0805]
C45  0.1uF  Package/Case: 0805  [SM-0805]
J6  USB Micro Type B (recommended if hand soldering)  [USB_Micro-B_FCI_SMD]  (value not drawn)
LED3  value Green  [Led 0805G]  (hidden comment: LED-0805GVC)
LED4  value Green  [Led 0805G]  (hidden comment: LED-0805GVC)
Q15  C1815  [SOT23-132]
Q16  C1815  [SOT23-132]
R87  470  [RES_0805]
R88  470  [RES_0805]
R89  10K  [RES_0805]
R90  10K  [RES_0805]
R91  470  [RES_0805]
R92  470  [RES_0805]
U4  CH340G  [CH340G]
X1  12MHz  [CRYSTAL_ABM3 5x3.2mm]

### Nets
+3.3V: C8.2 U4.4(V3)
GND: C8.1 C42.1 C43.2 C44.1 C45.1 J6.5(GND) J6.SH(Shell) U4.1(GND)
VBUS: C42.2 C45.2 J6.1(VBUS) U4.16(VCC)
VCC_3.3V: R91.1 R92.1
D+: J6.3(D+) U4.5(UD+)
D-: J6.2(D-) U4.6(UD-)
DTR: Q16.2(E) R89.1 U4.13(DTR#)
EN: Q15.3(C)
IO0: Q16.3(C)
RTS: Q15.2(E) R90.1 U4.14(RTS#)
UART_RXD0: LED3.2(K) R87.1
UART_TXD0: LED4.2(K) R88.1
NetC43_1: C43.1 U4.7(XI) X1.1(OSC1)
NetC44_2: C44.2 U4.8(XO) X1.2(OSC2)
NetLED3_1: LED3.1(A) R91.2
NetLED4_1: LED4.1(A) R92.2
NetQ15_1: Q15.1(B) R89.2
NetQ16_1: Q16.1(B) R90.2
NetR87_2: R87.2 U4.2(TXD)
NetR88_2: R88.2 U4.3(RXD)

Not connected (* = marked no-connect by the designer): J6 4(ID)*; U4 9(CTS#)* 10(DSR#)* 11(RI#)* 12(DSD#)* 15(R232)*

### Notes on the sheet
- (in symbol ABM3-12.000MHZ-D2Y-T) 12M

### Library data of the parts
C8 C42 C45 = Cap 0805_1: CAP 0805
C43 C44 = Tu 0805 22pF 50V 10%: Dán; Don_Vi: Con; So_Chan: 2; Ten_Linh_Kien: Tụ 0805 22P 10% 50V; Ma_Hang: MH004560; Chung_Loai: Dán; Kieu_Chan: *
J6 = USB_Micro_TypeB_FCI: Connector SMD-THD USB Micro Type B middle mount; Manufacturer 1: FCI; Manufacturer Part Number 1: 10103593-0001LF; SCDType: undef; Package / Case: SMD/THD mid-mount; Supplier 1: Digi-Key; Supplier Part Number 1: 609-4049-1-ND
LED3 LED4 = LED-0805GVC: LED Green 2mA 3V 0805; ComponentLink1Description: Datasheet; ComponentLink1URL: D:\Dropbox\Datasheets\Opto and Illumination\LEDs\SMD LED.pdf; Unit Price: 0.0476
Q15 Q16 = C1815 SMD: TRANS C1815 SOT23 TRANS NPN 0.15A 50V; Manufacturer: Minh Hà; Voltage: 45V; Supplier 1: Rochester Electronics; Part Number: C1815; Stock 1: 5904000; Pricing 1: 1=0.03, 25=0.03, 100=0.03, 500=0.03, 1000=0.03 (USD); ComponentLink1URL: http://www.farnell.com/datasheets/699988.pdf?src-supplier=Farnell; ComponentLink1Description: http://www.farnell.com/datasheets/699988.pdf?src-supplier=Farnell; ComponentLink2URL: http://www.farnell.com/datasheets/699988.pdf?src-supplier=Newark; ComponentLink2Description: http://www.farnell.com/datasheets/699988.pdf?src-supplier=Newark; ComponentLink3URL: https://www.mouser.com/ds/2/302/BC817_BC817W_BC337-188983.pdf?src-supplier=Mouser; ComponentLink3Description: https://www.mouser.com/ds/2/302/BC817_BC817W_BC337-188983.pdf?src-supplier=Mouser; ComponentLink4URL: https://assets.nexperia.com/documents/data-sheet/BC817_SER.pdf?src-supplier=Digi-Key; ComponentLink4Description: https://assets.nexperia.com/documents/data-sheet/BC817_SER.pdf?src-supplier=Digi-Key; Supplier Part Number 1: BC817-25,215; Current: 0.15A; ComponentLink5Description: Link VN; ComponentLink5URL: https://banlinhkien.com/c1815-sot23-trans-npn-0.15a-50v-hf-10c-p6860580.html
R87 R88 R91 R92 = RES 470R 0805 1% 1/8W: as R15 on sheet [1] PWR; ComponentLink1Description: Link VN; ComponentLink1URL: https://banlinhkien.com/tro-0805-1-470r-50c-p17823145.html; Package: 0805; Tolerance: 1%; Power: 1/8W
R89 R90 = RES 10K 0805 1% 1/8W: as R1 on sheet [2] ESP32; ComponentLink1Description: Link VN; ComponentLink1URL: https://banlinhkien.com/tro-0805-1-10k-50c-p6651952.html; Package: 0805; Tolerance: 1%; Power: 1/8W
U4 = CH340G: USB to serial chip CH340
X1 = ABM3-12.000MHZ-D2Y-T: CRYSTAL 12.0000MHZ 18pF SMD; Manufacturer: Abracon; Solder: SMT; CompanyID: VT-01247; Cross PN: H130A-12.000-18-2030-EXT-TR; Cross DES: CRYSTAL 12.0000MHZ 18PF SMD 5032 5.00mm x 3.20mm; Cross MNF: Raltron Electronics; Part Number: ABM3-12.000MHZ-D2Y-T; Value: 12MHz; Category: CRYSTAL

## Nets that join several sheets
GND: [1] PWR (18 pins), [2] ESP32 (25 pins), [3] USB (8 pins)
GND_IN: [1] PWR (9 pins), [2] ESP32 (11 pins)
GND_RS485_ISO: [1] PWR (C2.2 C11.1 LED5.2 M2.4), [2] ESP32 (13 pins)
VCC_3.3V: [1] PWR (C5.1 C10.2 FB4.2 R15.1), [2] ESP32 (18 pins), [3] USB (R91.1 R92.1)
VCC_5V: [1] PWR (C7.2 FB5.2 U9.3), [2] ESP32 (P1.1)
VCC_24V: [1] PWR (6 pins), [2] ESP32 (11 pins)
VCC_RS485_ISO: [1] PWR (C11.2 M2.6 R16.1), [2] ESP32 (8 pins)
EN: [2] ESP32 (C20.2 R57.1 SW1.1 U13.3), [3] USB (Q15.3)
IO0: [2] ESP32 (C21.2 R46.1 SW3.2 U13.25), [3] USB (Q16.3)
IO2: [1] PWR (R86.1), [2] ESP32 (R59.2 U13.24)
UART_RXD0: [2] ESP32 (C23.2 U13.34), [3] USB (LED3.2 R87.1)
UART_TXD0: [2] ESP32 (C23.3 U13.35), [3] USB (LED4.2 R88.1)